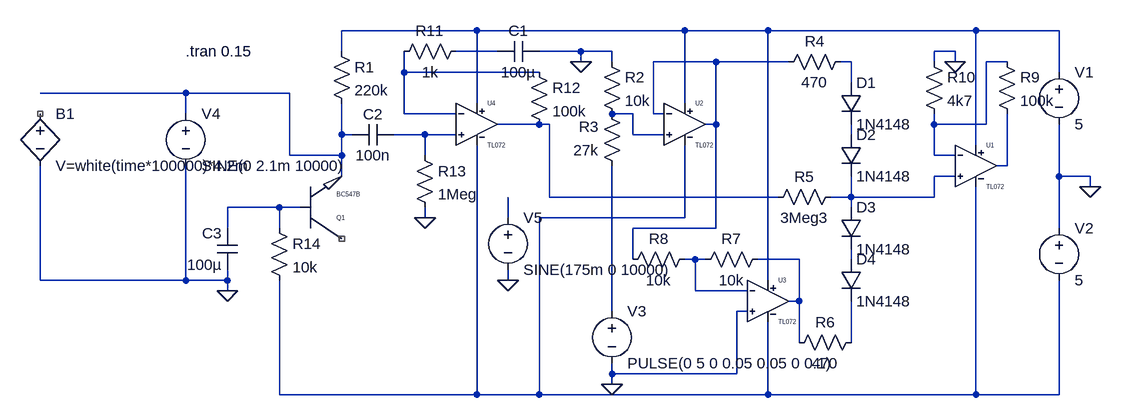
[diagram p0: schematic vcnoise.asc]
vcnoise.asc, the LTspice schematic file:
Version 4
SHEET 1 1192 680
WIRE 16 -64 -192 -64
WIRE 336 -64 16 -64
WIRE 464 -64 336 -64
WIRE 784 -64 464 -64
WIRE 912 -64 784 -64
WIRE -192 -32 -192 -64
WIRE 48 -32 -16 -32
WIRE 176 -32 112 -32
WIRE 224 -32 176 -32
WIRE 752 -32 720 -32
WIRE 176 -16 176 -32
WIRE 224 -16 224 -32
WIRE 384 -16 288 -16
WIRE 496 -16 384 -16
WIRE 592 -16 576 -16
WIRE 720 -16 720 -32
WIRE 752 -16 752 -32
WIRE 832 -16 800 -16
WIRE -96 0 -96 -32
WIRE 112 0 -96 0
WIRE 912 0 912 -64
WIRE 592 16 592 -16
WIRE -432 32 -656 32
WIRE -272 32 -432 32
WIRE 16 48 16 -64
WIRE 336 48 336 -64
WIRE -432 64 -432 32
WIRE -96 64 -96 0
WIRE -16 64 -96 64
WIRE 256 64 224 64
WIRE 288 64 288 -16
WIRE 304 64 288 64
WIRE 112 80 48 80
WIRE 128 80 112 80
WIRE 384 80 384 -16
WIRE 384 80 368 80
WIRE 720 80 720 64
WIRE 800 80 800 -16
WIRE 800 80 720 80
WIRE -192 96 -192 48
WIRE -176 96 -192 96
WIRE -64 96 -112 96
WIRE -16 96 -64 96
WIRE 256 96 256 64
WIRE 304 96 256 96
WIRE 592 96 592 80
WIRE 784 112 784 -64
WIRE -272 128 -272 32
WIRE -192 128 -192 96
WIRE -192 128 -272 128
WIRE -64 128 -64 96
WIRE 720 128 720 80
WIRE 752 128 720 128
WIRE 832 144 832 64
WIRE 832 144 816 144
WIRE -192 160 -192 128
WIRE 752 160 720 160
WIRE 912 160 912 80
WIRE 960 160 912 160
WIRE 960 176 960 160
WIRE 128 192 128 80
WIRE 480 192 128 192
WIRE 592 192 592 160
WIRE 592 192 560 192
WIRE 720 192 720 160
WIRE 720 192 592 192
WIRE -288 208 -368 208
WIRE -256 208 -288 208
WIRE 592 208 592 192
WIRE -64 224 -64 208
WIRE 64 224 64 192
WIRE 336 224 336 112
WIRE 336 224 112 224
WIRE -368 240 -368 208
WIRE -288 240 -288 208
WIRE 384 240 384 80
WIRE 384 240 256 240
WIRE 912 240 912 160
WIRE 256 288 256 240
WIRE 352 288 336 288
WIRE 368 288 352 288
WIRE 512 288 448 288
WIRE 592 288 592 272
WIRE -656 320 -656 144
WIRE -432 320 -432 144
WIRE -432 320 -656 320
WIRE -368 320 -368 304
WIRE -368 320 -432 320
WIRE 64 320 64 304
WIRE 464 320 464 -64
WIRE -368 336 -368 320
WIRE 352 336 352 288
WIRE 432 336 352 336
WIRE 512 352 512 288
WIRE 512 352 496 352
WIRE 224 368 224 144
WIRE 432 368 416 368
WIRE 512 416 512 352
WIRE 592 416 592 352
WIRE 224 464 224 448
WIRE 416 464 416 368
WIRE 416 464 224 464
WIRE 224 480 224 464
WIRE -288 496 -288 320
WIRE 16 496 16 112
WIRE 16 496 -288 496
WIRE 112 496 112 224
WIRE 112 496 16 496
WIRE 464 496 464 384
WIRE 464 496 112 496
WIRE 784 496 784 176
WIRE 784 496 464 496
WIRE 912 496 912 320
WIRE 912 496 784 496
FLAG 960 176 0
FLAG -368 336 0
FLAG 224 480 0
FLAG 752 -16 0
FLAG 176 -16 0
FLAG -64 224 0
FLAG 64 320 0
SYMBOL TL072 784 80 R0
SYMATTR InstName U1
SYMBOL BC547B -256 256 M180
SYMATTR InstName Q1
SYMBOL res -208 -48 R0
SYMATTR InstName R1
SYMATTR Value 220k
SYMBOL voltage 912 -16 R0
SYMATTR InstName V1
SYMATTR Value 5
SYMBOL voltage 912 224 R0
SYMATTR InstName V2
SYMATTR Value 5
SYMBOL bv -656 48 R0
SYMATTR InstName B1
SYMATTR Value V=white(time*100000)*4.2m
SYMBOL voltage 224 352 R0
WINDOW 123 0 0 Left 2
WINDOW 39 0 0 Left 2
SYMATTR InstName V3
SYMATTR Value PULSE(0 5 0 0.05 0.05 0 0.1)
SYMBOL diode 576 16 R0
SYMATTR InstName D1
SYMATTR Value 1N4148
SYMBOL diode 576 96 R0
SYMATTR InstName D2
SYMATTR Value 1N4148
SYMBOL diode 576 208 R0
SYMATTR InstName D3
SYMATTR Value 1N4148
SYMBOL diode 576 288 R0
SYMATTR InstName D4
SYMATTR Value 1N4148
SYMBOL res 592 -32 R90
WINDOW 0 0 56 VBottom 2
WINDOW 3 32 56 VTop 2
SYMATTR InstName R4
SYMATTR Value 470
SYMBOL res 576 176 R90
WINDOW 0 0 56 VBottom 2
WINDOW 3 32 56 VTop 2
SYMATTR InstName R5
SYMATTR Value 3Meg3
SYMBOL TL072 464 288 R0
SYMATTR InstName U3
SYMBOL res 608 400 R90
WINDOW 0 0 56 VBottom 2
WINDOW 3 32 56 VTop 2
SYMATTR InstName R6
SYMATTR Value 470
SYMBOL res 464 272 R90
WINDOW 0 0 56 VBottom 2
WINDOW 3 32 56 VTop 2
SYMATTR InstName R7
SYMATTR Value 10k
SYMBOL res 240 304 R270
WINDOW 0 32 56 VTop 2
WINDOW 3 0 56 VBottom 2
SYMATTR InstName R8
SYMATTR Value 10k
SYMBOL res 816 -32 R0
SYMATTR InstName R9
SYMATTR Value 100k
SYMBOL res 704 -32 R0
SYMATTR InstName R10
SYMATTR Value 4k7
SYMBOL voltage -432 48 R0
WINDOW 123 0 0 Left 2
WINDOW 39 24 108 Left 2
SYMATTR InstName V4
SYMATTR Value SINE(0 2.1m 10000)
SYMBOL TL072 336 16 R0
SYMATTR InstName U2
SYMBOL res 240 160 R180
WINDOW 0 36 76 Left 2
WINDOW 3 36 40 Left 2
SYMATTR InstName R3
SYMATTR Value 27k
SYMBOL res 208 -32 R0
SYMATTR InstName R2
SYMATTR Value 10k
SYMBOL TL072 16 16 R0
SYMATTR InstName U4
SYMBOL res 0 -48 R90
WINDOW 0 0 56 VBottom 2
WINDOW 3 32 56 VTop 2
SYMATTR InstName R11
SYMATTR Value 1k
SYMBOL cap 112 -48 R90
WINDOW 0 0 32 VBottom 2
WINDOW 3 32 32 VTop 2
SYMATTR InstName C1
SYMATTR Value 100µ
SYMBOL res 96 -16 R0
SYMATTR InstName R12
SYMATTR Value 100k
SYMBOL cap -112 80 R90
WINDOW 0 0 32 VBottom 2
WINDOW 3 32 32 VTop 2
SYMATTR InstName C2
SYMATTR Value 100n
SYMBOL res -80 112 R0
SYMATTR InstName R13
SYMATTR Value 1Meg
SYMBOL res -304 224 R0
SYMATTR InstName R14
SYMATTR Value 10k
SYMBOL cap -352 304 R180
WINDOW 0 24 56 Left 2
WINDOW 3 24 8 Left 2
SYMATTR InstName C3
SYMATTR Value 100µ
SYMBOL voltage 64 208 R0
WINDOW 123 0 0 Left 2
WINDOW 39 24 108 Left 2
SYMATTR InstName V5
SYMATTR Value SINE(175m 0 10000)
TEXT -432 -32 Left 2 !.tran 0.15

The netlist it stands for:
* vcnoise.asc
XU1 N013 N005 N001 N016 N012 TL072 TL072  ; pins In+ In- V+ V- OUT
Q1 NC_01 N014 N007 0 BC547B
R1 N001 N007 220k
V1 N001 0 5
V2 0 N016 5
B1 NC_02 0 V=white(time*100000)*4.2m
V3 N020 0 PULSE(0 5 0 0.05 0.05 0 0.1)
D1 N004 N011 1N4148
D2 N011 N013 1N4148
D3 N013 N019 1N4148
D4 N019 N021 1N4148
R4 N004 N003 470
R5 N013 N009 3Meg3
XU3 0 N017 N001 N016 N018 TL072 TL072  ; pins In+ In- V+ V- OUT
R6 N021 N018 470
R7 N018 N017 10k
R8 N003 N017 10k
R9 N005 N012 100k
R10 0 N005 4k7
V4 N007 0 SINE(0 2.1m 10000)
XU2 N008 N003 N001 N016 N003 TL072 TL072  ; pins In+ In- V+ V- OUT
R3 N020 N008 27k
R2 0 N008 10k
XU4 N010 N006 N001 N016 N009 TL072 TL072  ; pins In+ In- V+ V- OUT
R11 N002 N006 1k
C1 0 N002 100µ
R12 N006 N009 100k
C2 N010 N007 100n
R13 N010 0 1Meg
R14 N014 N016 10k
C3 0 N014 100µ
V5 N015 0 SINE(175m 0 10000)
.model D D
.lib standard.dio
.model NPN NPN
.model PNP PNP
.lib standard.bjt
.tran 0.15
.lib TL072.sub
.lib BC547B.MOD
.backanno
.end